# EAGLE design NodeSimpleEthernet (EAGLE 4.16)
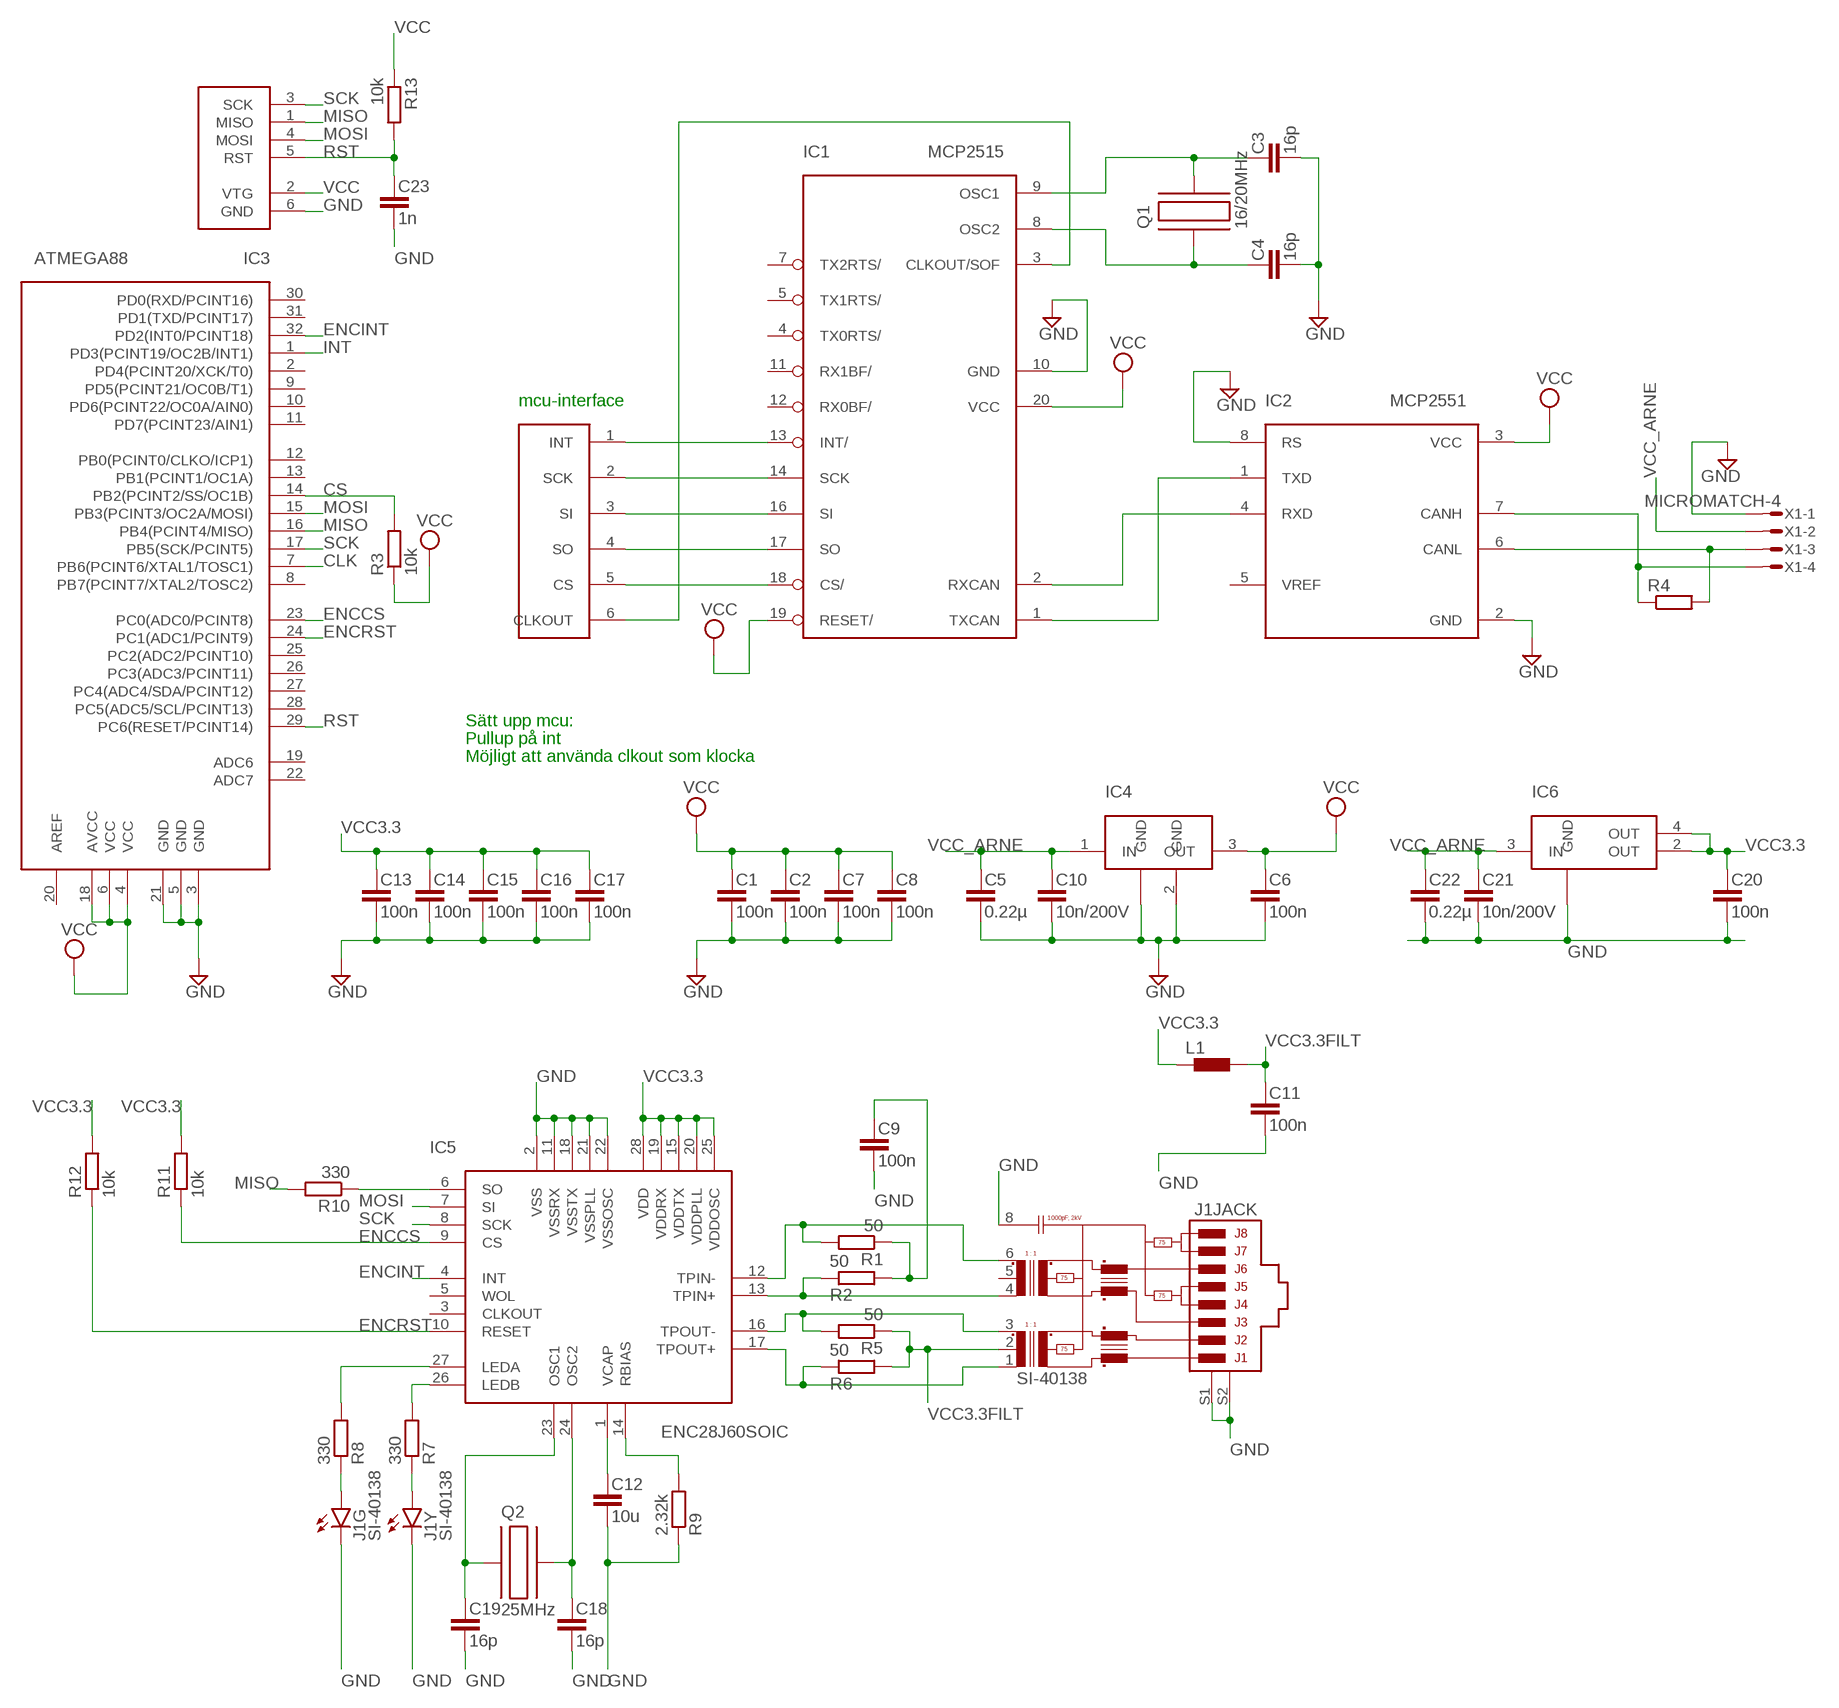
[diagram p0: schematic, sheet 1]

## Parts
C1  100n  C-EU  [C0603]
C2  100n  C-EU  [C0603]
C3  16p  C-EU  [C0603]
C4  16p  C-EU  [C0603]
C5  0.22µ  C-EU  [C0603]
C6  100n  C-EU  [C0603]
C7  100n  C-EU  [C0603]
C8  100n  C-EU  [C0603]
C9  100n  C-EU  [C0603]
C10  10n/200V  C-EU  [C0603]
C11  100n  C-EU  [C0603]
C12  10u  C-EU  [C0603]
C13  100n  C-EU  [C0603]
C14  100n  C-EU  [C0603]
C15  100n  C-EU  [C0603]
C16  100n  C-EU  [C0603]
C17  100n  C-EU  [C0603]
C18  16p  C-EU  [C0603]
C19  16p  C-EU  [C0603]
C20  100n  C-EU  [C0603]
C21  10n/200V  C-EU  [C0603]
C22  0.22µ  C-EU  [C0603]
C23  1n  C-EU  [C0603]
IC1  MCP2515  [TSSOP]
IC2  MCP2551  [SOIC]
IC3  ATMEGA88  [TQFP32]
IC4  LM340MP-5.0  [SOT223]
IC5  ENC28J60SOIC  [SOIC-28]
IC6  LM1117MP-3.3  [SOT223]
J1  SI-40138  [SI-40138]
L1  L-EUL0603  [L0603]
Q1  16/20MHz  C-MAC-LFA147E  [SMD]
Q2  25MHz  C-MAC-LFA147E  [SMD]
R1  50  R-EUR0603  [R0603]
R2  50  R-EUR0603  [R0603]
R3  10k  R-EUR0603  [R0603]
R4  R-EUR0603  [R0603]
R5  50  R-EUR0603  [R0603]
R6  50  R-EUR0603  [R0603]
R7  330  R-EUR0603  [R0603]
R8  330  R-EUR0603  [R0603]
R9  2.32k  R-EUR0603  [R0603]
R10  330  R-EUR0603  [R0603]
R11  10k  R-EUR0603  [R0603]
R12  10k  R-EUR0603  [R0603]
R13  10k  R-EUR0603  [R0603]
U$1  CAN-INTERFACE  [VIA-LIST]
X1  MICROMATCH-4  [MICROMATCH-4]
X2  AVRISP6PIN  [6PIN]

## Nets
CANH: IC2.7(CANH) R4.1 X1.4
CANL: IC2.6(CANL) R4.2 X1.3
CLK: IC1.3(CLKOUT/SOF) IC3.7(PB6(PCINT6/XTAL1/TOSC1)) U$1.6(CLKOUT)
CS: IC1.18(CS/) IC3.14(PB2(PCINT2/SS/OC1B)) R3.2 U$1.5(CS)
ENCCS: IC3.23(PC0(ADC0/PCINT8)) IC5.9(CS) R11.1
ENCINT: IC3.32(PD2(INT0/PCINT18)) IC5.4(INT)
ENCRST: IC3.24(PC1(ADC1/PCINT9)) IC5.10(RESET) R12.1
GND: C1.2 C2.2 C3.2 C4.2 C5.2 C6.2 C7.2 C8.2 C9.2 C10.2 C11.2 C12.2 C13.2 C14.2 C15.2 C16.2 C17.2 C18.2 C19.2 C20.2 C21.2 C22.2 C23.2 IC1.10(GND) IC2.2(GND) IC2.8(RS) IC3.3(GND) IC3.5(GND) IC3.21(GND) IC4.2(GND) IC4.4(GND) IC5.2(VSS) IC5.11(VSSRX) IC5.18(VSSTX) IC5.21(VSSPLL) IC5.22(VSSOSC) IC6.1(GND) J1.8(JACK:GND) J1.GC(G:C) J1.S1(JACK:S1) J1.S2(JACK:S2) J1.YC(Y:C) R9.1 X1.1 X2.6(GND)
INT: IC1.13(INT/) IC3.1(PD3(PCINT19/OC2B/INT1)) U$1.1(INT)
MISO: IC1.17(SO) IC3.16(PB4(PCINT4/MISO)) R10.2 U$1.4(SO) X2.1(MISO)
MOSI: IC1.16(SI) IC3.15(PB3(PCINT3/OC2A/MOSI)) IC5.7(SI) U$1.3(SI) X2.4(MOSI)
N$1: IC1.2(RXCAN) IC2.4(RXD)
N$2: IC1.1(TXCAN) IC2.1(TXD)
N$3: IC5.12(TPIN-) J1.6(JACK:TD+) R1.2
N$4: IC5.13(TPIN+) J1.4(JACK:TD-) R2.1
N$5: IC5.16(TPOUT-) J1.3(JACK:RD+) R5.2
N$6: IC5.17(TPOUT+) J1.1(JACK:RD-) R6.1
N$9: IC5.27(LEDA) R8.2
N$11: C9.1 R1.1 R2.2
N$12: C3.1 IC1.9(OSC1) Q1.P$2
N$13: C4.1 IC1.8(OSC2) Q1.P$1
N$14: IC5.26(LEDB) R7.2
N$15: C19.1 IC5.23(OSC1) Q2.P$1
N$16: C18.1 IC5.24(OSC2) Q2.P$2
N$17: C12.1 IC5.1(VCAP)
N$18: IC5.14(RBIAS) R9.2
N$19: J1.YA(Y:A) R7.1
N$20: J1.GA(G:A) R8.1
RST: C23.1 IC3.29(PC6(RESET/PCINT14)) R13.2 X2.5(RST)
SCK: IC1.14(SCK) IC3.17(PB5(SCK/PCINT5)) IC5.8(SCK) U$1.2(SCK) X2.3(SCK)
SO: IC5.6(SO) R10.1
VCC: C1.1 C2.1 C6.1 C7.1 C8.1 IC1.19(RESET/) IC1.20(VCC) IC2.3(VCC) IC3.4(VCC) IC3.6(VCC) IC3.18(AVCC) IC4.3(OUT) R3.1 R13.1 X2.2(VTG)
VCC3.3: C13.1 C14.1 C15.1 C16.1 C17.1 C20.1 IC5.15(VDDTX) IC5.19(VDDRX) IC5.20(VDDPLL) IC5.25(VDDOSC) IC5.28(VDD) IC6.2(OUT) IC6.4(OUT) L1.1 R11.2 R12.2
VCC3.3FILT: C11.1 J1.2(JACK:CTR) L1.2 R5.1 R6.2
VCC_ARNE: C5.1 C10.1 C21.1 C22.1 IC4.1(IN) IC6.3(IN) X1.2
Unconnected: IC1.4(TX0RTS/) IC1.5(TX1RTS/) IC1.7(TX2RTS/) IC1.11(RX1BF/) IC1.12(RX0BF/) IC2.5(VREF) IC3.2(PD4(PCINT20/XCK/T0)) IC3.8(PB7(PCINT7/XTAL2/TOSC2)) IC3.9(PD5(PCINT21/OC0B/T1)) IC3.10(PD6(PCINT22/OC0A/AIN0)) IC3.11(PD7(PCINT23/AIN1)) IC3.12(PB0(PCINT0/CLKO/ICP1)) IC3.13(PB1(PCINT1/OC1A)) IC3.19(ADC6) IC3.20(AREF) IC3.22(ADC7) IC3.25(PC2(ADC2/PCINT10)) IC3.26(PC3(ADC3/PCINT11)) IC3.27(PC4(ADC4/SDA/PCINT12)) IC3.28(PC5(ADC5/SCL/PCINT13)) IC3.30(PD0(RXD/PCINT16)) IC3.31(PD1(TXD/PCINT17)) IC5.3(CLKOUT) IC5.5(WOL) J1.5(JACK:CTT)

## Notes on the sheet
- mcu-interface
- Sätt upp mcu:
- Pullup på int
- Möjligt att använda clkout som klocka

## Library data of the parts
C1-C23 = rcl:C-EU
IC1 = mcp2515:MCP2515
IC2 = mcp2551:MCP2551
IC3 = atmega88:ATMEGA88
IC4 = lm340mp:LM340MP-5.0
IC5 = enc28j60:ENC28J60
IC6 = lm1117mp:LM1117MP-3.3
J1 = stewart_magjack:SI-40138
L1 = rcl:L-EU
Q1 Q2 = hc49-4h-smx:C-MAC-LFA147E
R1-R13 = rcl:R-EU
U$1 = can-interface:CAN-INTERFACE
X1 = con-amp-micromatch:MICROMATCH-4: MicroMaTch 4 7-215464-4 / 0-215464-4 Drawing Number C-215464 DDEController.pdf
X2 = avrisp:AVRISP6PIN

## Board
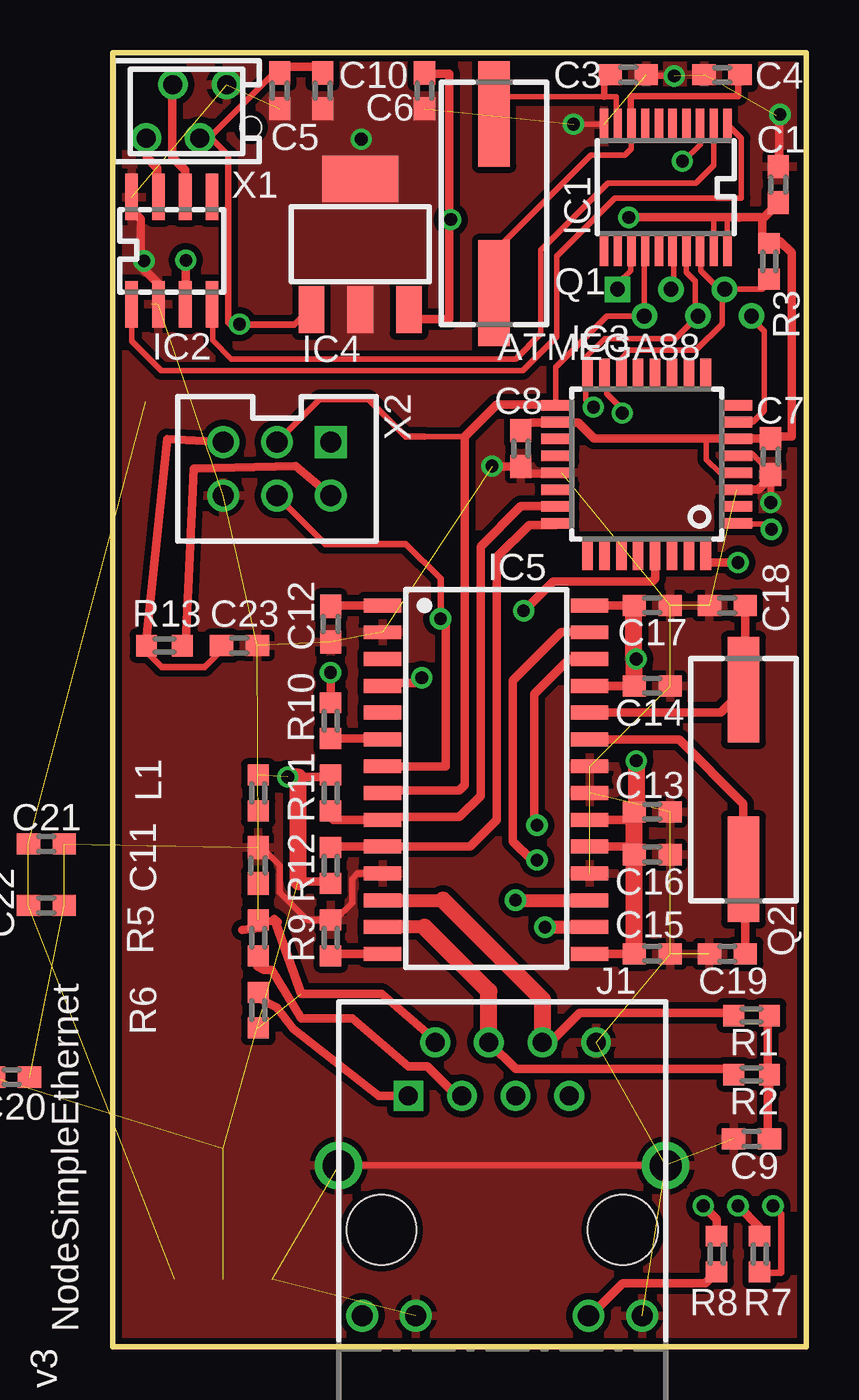
[diagram p1: board, top side]
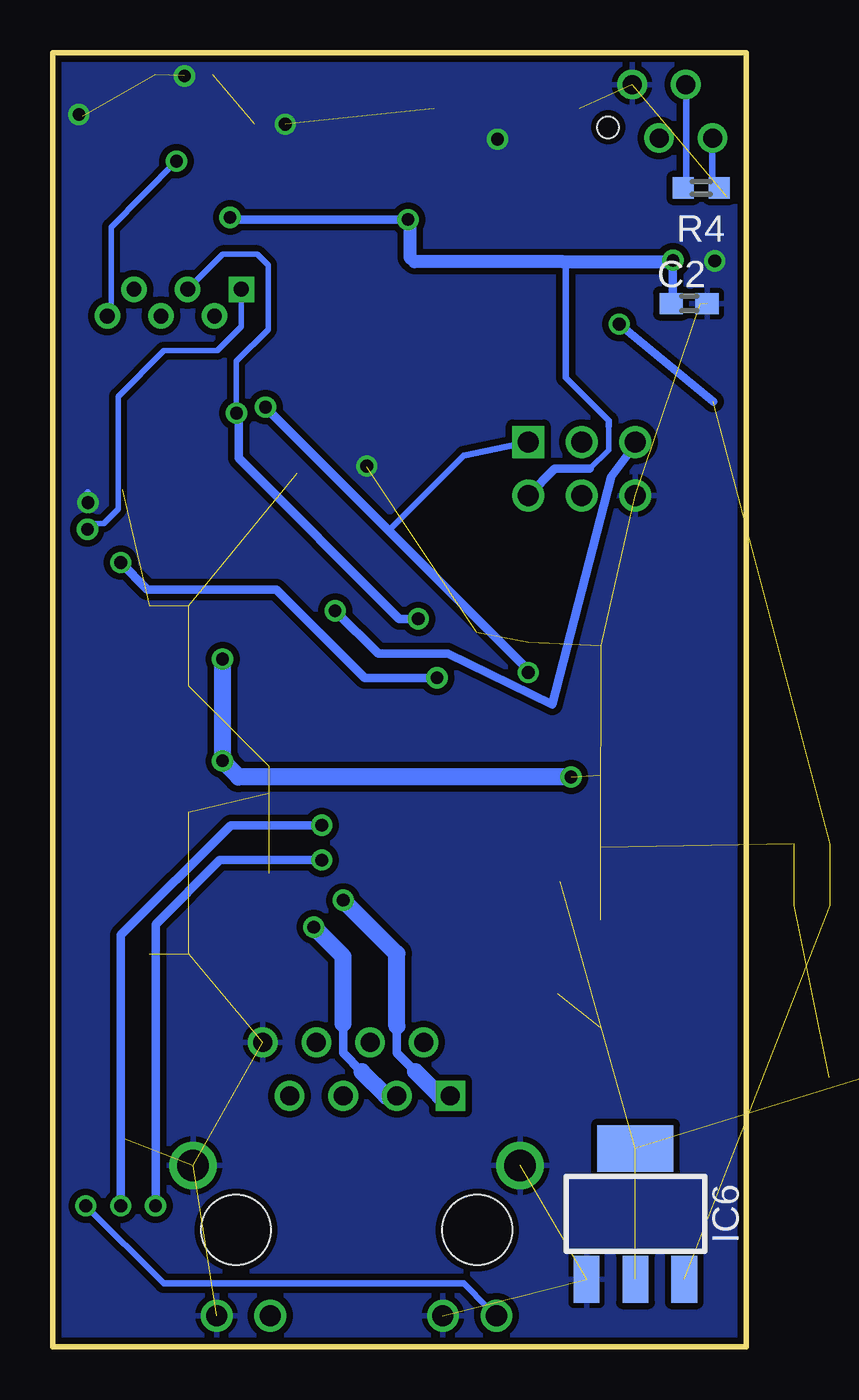
[diagram p2: board, bottom side, seen from below]

Size 32.85 x 61.32 mm. Coordinates in mm from the lower left corner, seen from the top.
Outline: 0,0 32.85,0 32.85,61.32 0,61.32 0,0
Copper layers (1*16): Top 0.035mm / dielectric 1.5mm / Bottom 0.035mm
Design rules "10mils, 0.6drill": minimum track width 10mil, minimum drill 0.6mm, track to track 10mil, track to pad 10mil, pad to pad 10mil, via to via 10mil, smd to smd 10mil, copper to edge 10mil, drill to drill 10mil, minimum pad ring 10mil, minimum via ring 8mil, stop-mask expansion 0mil, vias tented up to drill 0mil, thermal gap 10mil

### Footprints (pad centres in the part's own frame; a part is rotated, then mirrored left to right if it is on the bottom)
C0603 = smd 1.1 x 1: 1 -0.85,0; 2 0.85,0
TSSOP = smd 0.396 x 1.5: 1 -2.925,-2.975; 2 -2.275,-2.975; 3 -1.625,-2.975; 4 -0.975,-2.975; 5 -0.325,-2.975; 6 0.325,-2.975; 7 0.975,-2.975; 8 1.625,-2.975; 9 2.275,-2.975; 10 2.925,-2.975; 11 2.925,2.975; 12 2.275,2.975; 13 1.625,2.975; 14 0.975,2.975; 15 0.325,2.975; 16 -0.325,2.975; 17 -0.975,2.975; 18 -1.625,2.975; 19 -2.275,2.975; 20 -2.925,2.975
SOIC = smd 0.6 x 2.2: 1 -1.905,-2.54; 2 -0.635,-2.54; 3 0.635,-2.54; 4 1.905,-2.54; 5 1.905,2.54; 6 0.635,2.54; 7 -0.635,2.54; 8 -1.905,2.54
TQFP32 = smd 1.5 x 0.5: 1 -4.25,2.65; 2 -4.25,1.85; 3 -4.25,1.05; 4 -4.25,0.25; 5 -4.25,-0.55; 6 -4.25,-1.35; 7 -4.25,-2.15; 8 -4.25,-2.95; 17 4.25,-2.95; 18 4.25,-2.15; 19 4.25,-1.35; 20 4.25,-0.55; 21 4.25,0.25; 22 4.25,1.05; 23 4.25,1.85; 24 4.25,2.65 | smd 0.5 x 1.5: 9 -2.8,-4.4; 10 -2,-4.4; 11 -1.2,-4.4; 12 -0.4,-4.4; 13 0.4,-4.4; 14 1.2,-4.4; 15 2,-4.4; 16 2.8,-4.4; 25 2.8,4.1; 26 2,4.1; 27 1.2,4.1; 28 0.4,4.1; 29 -0.4,4.1; 30 -1.2,4.1; 31 -2,4.1; 32 -2.8,4.1
SOT223 = smd 1.219 x 2.235: 1 -2.311,-3.099; 2 0,-3.099; 3 2.311,-3.099 | smd 3.6 x 2.2: 4 0,3.099
SOIC-28 = smd 0.66 x 1.778: 1 -6.985,-4.902; 2 -5.715,-4.902; 3 -4.445,-4.902; 4 -3.175,-4.902; 5 -1.905,-4.902; 6 -0.635,-4.902; 7 0.635,-4.902; 8 1.905,-4.902; 9 3.175,-4.902; 10 4.445,-4.902; 11 5.715,-4.902; 12 6.985,-4.902; 13 8.255,-4.902; 14 9.525,-4.902; 15 9.525,4.902; 16 8.255,4.902; 17 6.985,4.902; 18 5.715,4.902; 19 4.445,4.902; 20 3.175,4.902; 21 1.905,4.902; 22 0.635,4.902; 23 -0.635,4.902; 24 -1.905,4.902; 25 -3.175,4.902; 26 -4.445,4.902; 27 -5.715,4.902; 28 -6.985,4.902
SI-40138 = drill 0.9 square: 1 -4.445,6.35 | drill 0.9 round: 2 -3.175,8.89; 3 -1.905,6.35; 4 -0.635,8.89; 5 0.635,6.35; 6 1.905,8.89; 7 3.175,6.35; 8 4.445,8.89 | drill 1 round: GA 4.089,-4.064; GC 6.629,-4.064; YA -6.629,-4.064; YC -4.089,-4.064 | drill 1.5 round: S1 -7.747,3.048; S2 7.747,3.048 | hole 3.3: -5.715,0; 5.715,0
L0603 = smd 0.991 x 1.016: 1 -0.85,0; 2 0.85,0
SMD = smd 5 x 1.5: P$1 4.25,0; P$2 -4.25,0
R0603 = smd 0.991 x 1.016: 1 -0.85,0; 2 0.85,0
VIA-LIST = drill 0.7 square: 1 0,2.54 | drill 0.7 round: 2 -1.27,1.27; 3 0,0; 4 -1.27,-1.27; 5 0,-2.54; 6 -1.27,-3.81
MICROMATCH-4 = drill 0.9 round: 1 1.905,1.27; 2 0.635,-1.27; 3 -0.635,1.27; 4 -1.905,-1.27 | hole 1: 3.048,-0.762
6PIN = drill 1 square: 1 -1.27,2.54 | drill 1 round: 2 1.27,2.54; 3 -1.27,0; 4 1.27,0; 5 -1.27,-2.54; 6 1.27,-2.54

### Placement (x,y rotation side)
C1  31.54,55.07 90 top
C2  2.7,49.44 0 bottom
C3  24.43,60.27 0 top
C4  28.87,60.27 180 top
C5  7.92,59.51 270 top
C6  14.77,59.51 270 top
C7  31.17,42.18 270 top
C8  19.34,42.56 270 top
C9  30.27,9.86 180 top
C10  9.95,59.51 270 top
C11  6.9,22.81 90 top
C12  10.33,34.24 270 top
C13  25.57,25.35 0 top
C14  25.57,31.32 0 top
C15  25.57,18.62 0 top
C16  25.57,23.32 0 top
C17  25.57,35.13 0 top
C18  29.12,35.13 180 top
C19  29.12,18.62 180 top
C20  -4.78,12.78 0 top  (outside the outline)
C21  -3.13,23.83 0 top
C22  -3.13,20.91 0 top
C23  6.01,33.22 0 top
IC1  26.21,54.94 180 top
IC2  2.8,51.94 0 top
IC3  25.3,41.67 180 top
IC4  11.73,52.25 0 top
IC5  17.7,28.14 270 top
IC6  5.25,6.3 0 bottom
J1  18.46,5.54 0 top
L1  6.9,26.24 270 top
Q1  18.08,54.18 270 top
Q2  29.89,26.87 270 top
R1  30.27,15.7 180 top
R2  30.27,12.9 0 top
R3  31.11,51.44 270 top
R4  2.12,54.92 180 bottom
R5  6.9,19.38 270 top
R6  6.9,15.95 270 top
R7  30.65,4.39 90 top
R8  28.62,4.39 90 top
R9  10.33,19.38 270 top
R10  10.33,29.67 90 top
R11  10.33,26.24 90 top
R12  10.33,22.81 270 top
R13  2.46,33.22 180 top
U$1  26.46,50.12 90 top
X1  3.5,58.55 0 top
X2  7.79,41.61 270 top

### Tracks (layer width: path | path; a pad name or v marks a point on that pad's centre or on a via)
CANH
  Top 0.305: 2.12,54.52 IC2.7 | X1.4 1.62,57.28
  Top 0.406: 2.12,54.52 2.12,55.86 1.62,56.36 1.62,57.28
  Bottom 0.305: X1.4 1.62,57.28 1.62,55.26 R4.1
CANL
  Top 0.305: IC2.6 | X1.3 2.84,59.82
  Top 0.406: IC2.6 3.45,55.75 2.84,56.36 2.84,59.82
  Bottom 0.305: X1.3 2.84,59.82 2.84,55.05 R4.2
CLK  (via drill 0.6)
  Top 0.254: IC1.3 27.83,57.81 27.83,56.97 27.02,56.16 v26.99,56.19 | IC3.7 30.32,43.82 30.88,44.38 30.88,48.13 30.22,48.79 30.17,48.84
  Top 0.406: 30.17,48.74 30.22,48.79 U$1.6
  Bottom 0.254: v26.99,56.19 30.09,53.06 30.09,49 U$1.6
CS
  Top 0.254: IC1.18 27.83,52.09 27.86,52.09 27.86,51 28.87,49.99 | IC3.14 24.07,46.2 | 24.07,46.2 24.07,46.22 | 28.87,49.99 28.87,48.46 27.63,47.22 24.48,47.22 24.07,46.81 24.07,46.41 24.17,45.7 24.07,46.2 | 28.87,49.99 U$1.5 30.78,50.12 31.03,50.37 31.03,50.57 30.97,50.57 R3.2
ENCCS
  Top 0.406: R11.1 10.46,25.39 10.46,24.97 IC5.9 13,24.97 13.12,25.1 16.43,25.1 17.44,26.11 17.44,37.92 19.35,39.83 21,39.83 21.01,39.82 IC3.23
ENCINT  (via drill 0.6)
  Top 0.406: IC5.4 12.87,31.32 13,31.45 14.65,31.45 v14.65,31.7 | IC3.32 28.1,37.42 28.11,37.16 v29.63,37.16
  Bottom 0.406: v14.65,31.7 18.08,31.7 22.27,35.89 28.36,35.89 v29.63,37.16
ENCRST
  Top 0.406: R12.1 10.33,23.7 IC5.10 16.93,23.7 18.2,24.97 18.2,37.41 19.73,38.94 21,38.94 21.05,38.99 IC3.24
GND  (via drill 0.6)  (33 unrouted)
  Top 0.254: v21.84,57.94 23.28,57.94 IC1.10 | C1.2 31.59,56.24 | 1.34,51.21 v1.49,51.46 | 20.56,41.38 IC3.21 21.28,41.4 | C8.2 19.8,41.38 | C7.2 31.11,41.66 30.93,41.66 30.32,42.29 29.76,42.24 29.74,42.22 IC3.5 | v31.61,58.4 31.44,58.34 31.59,58.19
  Top 0.305: IC2.2 2.2,49.73 | C3.2 25.45,60.22 v26.61,60.22 | 30.93,41.66 31.16,41.66 31.18,41.63 31.18,41.12 v31.18,40.01 | J1.S1 J1.S2 | IC5.11 11.6,22.43 11.34,22.18 11.34,21.03 10.46,20.14 10.37,20.23 R9.1 9.23,20.23 7.92,21.54 7.92,22.81 6.9,23.83 6.86,23.66 C11.2
  Top 0.406: 2.2,49.73 2.2,50.34 1.34,51.21 1.34,53.44 0.83,53.95 IC2.8 | 19.8,41.38 20.56,41.38 | 31.59,56.24 31.59,58.19 | 31.18,41.12 31.08,41.12 30.58,40.62 IC3.3 | C8.2 18,41.71 v17.97,41.73
  Bottom 0.305: v26.61,60.22 26.56,60.3 | v31.18,40.01 31.18,40.51
  Bottom 0.406: v17.97,41.73 18.08,41.73
  other vias: 11.78,57.22
  pour Bottom (isolate 0.305, rank 2): 0.12,61.21 32.83,61.21 32.83,0.1 24.38,0.1 0.12,0.1
  pour Top (isolate 0.305, no thermals): 5.83,60.85 15.89,60.85 15.89,47.13 5.83,47.13
  pour Top (isolate 0.305, rank 2): 0.17,61.16 32.68,61.16 32.68,0.08 0.17,0.08
INT  (via drill 0.6)
  Top 0.254: IC1.13 | IC1.13 | U$1.1 23.92,50.37 24.55,51 24.55,51.94 IC1.13 | IC3.1 29.48,39.02 29.46,38.99 30.01,39.04 30.07,38.99 30.95,38.99 v31.21,38.74
  Bottom 0.254: v31.21,38.74 30.9,39.02 30.45,39.02 29.76,39.7 29.76,45.04 27.6,47.19 25.06,47.19 23.92,48.34 U$1.1
MISO  (via drill 0.6)
  Top 0.254: IC1.17 27.18,52.03 27.17,52.02 27.17,50.93 27.6,50.5 27.6,49.1 27.73,48.97 U$1.4 26.66,47.78 23.31,47.78 22.45,46.91 22.45,45.59 22.44,45.59 22.41,45.59 | 22.41,45.59 IC3.16 | 22.41,45.59 22.39,45.66 | 22.41,45.59 22.41,44.89 v22.77,44.53
  Top 0.406: R10.2 v10.33,31.95
  Bottom 0.305: X2.1 13.38,42.24 16.93,38.69
  Bottom 0.406: v22.77,44.53 16.93,38.69 10.33,32.08 v10.33,31.95
MOSI  (via drill 0.6)
  Top 0.254: IC1.16 26.53,52.09 26.51,52.07 26.51,51.84 26.58,51.77 26.58,50.24 U$1.3 | IC3.15 23.3,46.04 23.26,46 23.26,45.95 23.41,45.8 23.41,45.16 24.15,44.43 v24.15,44.25
  Top 0.305: v15.54,34.49 15.54,36.4 13.88,38.05 10.07,38.05 X2.4
  Top 0.406: IC5.7 15.79,27.51 15.79,34.37 v15.54,34.49
  Bottom 0.254: U$1.3 26.51,50.17 | U$1.3 26.41,50.06 | v24.15,44.25 24.15,46.71 22.65,48.21 22.65,51.26 23.16,51.77 24.81,51.77 U$1.3
  Bottom 0.406: v15.54,34.49 16.43,34.49 24.04,42.11 24.04,44.15 v24.15,44.25 23.92,44.27
N$1
  Top 0.254: 4.77,49.35 4.75,49.35 IC2.4 4.71,49.38 4.74,49.35 4.74,47.7 5.63,46.81 19.09,46.81 20.29,48.01 20.29,51.97 23.46,55.14 27.63,55.14 28.48,56 IC1.2
N$2
  Top 0.254: IC1.1 29.79,57.27 29.79,54.43 23.79,54.43 21.05,51.69 21.05,47.88 19.42,46.25 2.3,46.25 0.91,47.65 IC2.1 | IC2.1 0.91,49.45 | IC2.1
N$3
  Top 0.406: R1.2 29.29,15.79 29.12,15.82 22.14,15.82 20.74,14.43 J1.6
  Top 0.61: IC5.12 15.66,21.16
  Top 0.813: J1.6 20.36,16.46 15.66,21.16
N$4
  Top 0.406: R2.1 29.42,12.74 29.25,13.16 19.09,13.16 J1.4
  Top 0.61: 14.77,19.89 IC5.13
  Top 0.813: J1.4 17.82,16.84 14.77,19.89
N$5  (via drill 0.6)
  Top 0.406: R5.2 6.86,18.02 7.15,17.86 7.54,17.86 8.93,15.57 11.34,15.57 14.01,13.29 14.9,13.29 16.3,11.89 J1.3
  Top 0.61: v20.49,19.89 IC5.16
  Bottom 0.406: 18.2,13.03 19.09,13.92 19.09,15.32
  Bottom 0.813: J1.3 17.06,11.89 18.2,13.03 | 19.09,15.32 19.09,18.49 v20.49,19.89
N$6  (via drill 0.6)
  Top 0.406: R6.1 7.11,16.42 7.79,16.08 8.55,15.06 12.61,11.89 J1.1 | IC5.17 22.65,21.16
  Top 0.61: v19.09,21.16 IC5.17
  Bottom 0.406: 15.66,13.03 16.55,13.92 16.55,15.19
  Bottom 0.813: J1.1 14.52,11.89 15.66,13.03 | 16.55,15.19 16.55,18.62 v19.09,21.16
N$9  (via drill 0.6)
  Top 0.406: R8.2 28.62,6.05 v27.98,6.68 | v20.11,23.06 19.85,23.06 18.96,23.95 18.96,31.57 21.25,33.86 IC5.27
  Bottom 0.406: v27.98,6.68 27.98,20.02 24.93,23.06 v20.11,23.06
N$11
  Top 0.406: C9.1 31.32,10.02 31.03,10.11 31.03,11.89 31.12,11.98 R2.2 31.12,12.05 31.03,12.14 31.03,15.57 R1.1
N$12
  Top 0.254: IC1.9 23.87,58.27 23.87,59.23 23.28,59.23 18.13,59.23 Q1.P$2
  Top 0.305: C3.1 23.28,59.8 23.28,59.23
N$13
  Top 0.254: Q1.P$1 18.14,51.96 22.65,56.47 24.27,56.47 24.58,56.77 24.58,57.68 24.55,57.71 24.55,57.79
  Top 0.305: IC1.8 24.55,57.79 24.55,59.26 29.63,59.26 29.63,60.31 C4.1
N$14  (via drill 0.6)
  Top 0.305: R7.2 30.65,5.63
  Top 0.406: 30.65,5.63 v29.63,6.68 | v20.11,24.71 19.98,25.1 19.98,30.94 21.63,32.59 IC5.26
  Bottom 0.406: v29.63,6.68 29.63,19.51 24.43,24.71 v20.11,24.71
N$15
  Top 0.406: 29.89,22.56 Q2.P$1 29.89,22.68 | C19.1 29.97,22.6 29.89,22.68 | 29.89,22.68 29.89,25.73 26.84,28.78 IC5.23
N$16
  Top 0.406: C18.1 29.97,31.15 29.89,31.06 Q2.P$2 28.81,30.05 IC5.24
N$17
  Top 0.406: C12.1 10.33,35.13 IC5.1
N$18
  Top 0.406: R9.2 10.33,18.62 IC5.14
N$19  (via drill 0.6)
  Top 0.305: v31.28,6.68 31.67,6.3 31.67,3.51 30.78,3.51 30.74,3.54 R7.1
  Bottom 0.305: J1.YA 11.83,1.83 11.85,1.85 12.23,1.85 13.38,3 27.6,3 v31.28,6.68
N$20
  Top 0.406: R8.1 28.07,3 24.17,3 22.52,1.35 22.52,1.45 J1.GA
RST  (via drill 0.6)
  Top 0.305: 1.57,33.22 1.57,32.97 2.33,32.21 4.36,32.21 5.16,33.01 C23.1
  Top 0.406: IC3.29 25.7,36.4 25.57,36.27 20.87,36.27 v19.47,34.88 | X2.5 2.58,43 1.57,33.26 R13.2 1.57,33.22
  Bottom 0.406: v19.47,34.88 17.44,32.84 14.14,32.84 9.19,30.43 6.39,41.23 5.25,42.75 X2.5
SCK
  Top 0.254: IC1.14 25.23,52.06 25.19,52.02 IC1.14 25.19,51.97 U$1.2 23.41,48.84 21,46.43 21,44.65 21,44.55 IC3.17 | 16.68,43.13 14.77,43.13
  Top 0.305: 14.77,43.13 13.88,43.13 12.11,44.91 9.82,44.91 X2.3
  Top 0.406: IC5.8 12.87,26.24 13,26.37 16.43,26.37 16.68,26.62 16.68,43.13 18.2,44.65 21,44.65 21.03,44.62 IC3.17
SO
  Top 0.406: IC5.6 12.87,28.78 12.87,28.82 R10.1
VCC  (via drill 0.6)
  Top 0.254: 29.81,43.03 IC3.6 29.05,43.03 | 21.28,43.79 IC3.18 | IC1.20 29.12,52.09 29.12,53.52 29.68,53.52 | IC1.19 28.48,52.03 28.49,52.02 28.49,53.52 28.49,53.54 | 30.57,53.57 30.78,53.57 30.9,53.54 | IC3.4 28.75,41.42 28.13,42.04 28.13,43.03
  Top 0.406: 15.95,53.42 15.95,48.71 14.08,48.71 14.08,49.4 IC4.3 | IC2.3 3.42,49.79 3.47,50.27 v3.47,51.49 | 15.95,53.42 15.95,60.33 14.83,60.33 14.77,60.27 C6.1 | v16.02,53.42 15.95,53.42 | v24.45,53.52 28.49,53.52 29.68,53.52 | 29.68,53.52 | IC3.18 20.56,43.79 19.8,43.79 C8.1 | 29.81,43.03 30.7,43.03 C7.1 31.41,43.13 32.17,43.13 32.17,51.84 31.61,52.4 30.88,52.4 | 21.28,43.79 22.06,43.79 22.83,43.03 28.13,43.03 29.05,43.03 | 29.68,53.52 30.78,53.52 | 30.78,53.52 30.9,53.52 30.9,53.54 C1.1 | 30.88,52.4 30.88,52.31 R3.1 | 30.88,52.4 30.78,52.5 30.78,53.52 | R13.1 3.43,33.35 3.47,33.35 3.85,41.61 8.68,41.73 X2.2
  Bottom 0.254: 3.47,49.94 C2.1 | 7.41,41.61 6.52,42.49 6.52,43.64
  Bottom 0.305: 6.52,43.64 6.52,43.89 8.55,45.92 8.55,51.26 8.68,51.38 8.68,51.41
  Bottom 0.406: 3.47,49.94 3.47,51.41 v3.47,51.49 | v24.45,53.52 24.4,53.52 24.3,53.42 v16.02,53.42 | X2.2 9.06,41.61 7.41,41.61 | C2.1 3.6,49.48 | C2.1 | C2.1 3.34,49.23
  Bottom 0.61: 3.47,51.41 8.68,51.41 15.71,51.41 15.92,51.61 15.92,53.42 v16.02,53.42
VCC3.3  (via drill 0.6)  (4 unrouted)
  Top 0.406: 24.68,35.13 IC5.28 | C14.1 IC5.25 | IC5.20 24.3,24.97 24.68,25.35 | IC5.19 24.3,23.7 24.68,23.32 | C15.1 IC5.15 | v24.81,32.59 24.68,32.59 | R11.2 10.29,27.09 10.2,27 8.8,27 | R12.2 10.29,21.96 10.2,22.05 8.8,22.05
  Top 0.813: 24.68,23.32 C16.1 | C15.1 24.68,18.62 24.68,23.32 | C14.1 24.68,31.32 24.68,32.59 24.68,35.13 C17.1 | 24.68,23.32 24.68,25.35 C13.1 24.81,25.35 v24.81,27.76 | 8.8,22.05 8.8,27 v8.3,27
  Bottom 0.813: v24.81,32.59 v24.81,27.76 24.04,27 v8.3,27
VCC3.3FILT  (3 unrouted)
  Top 0.406: 6.14,19.76 6.99,19.85 R5.1 7.83,20.14 7.66,20.27 8.93,16.71 12.74,16.71 15.41,14.43 J1.2
VCC_ARNE  (via drill 0.6)  (3 unrouted)
  Top 0.254: 7.88,60.33 C5.1
  Top 0.305: IC4.1 9.31,49.15 8.61,48.44 6.14,48.44 5.58,48.44 5.48,48.54 5.48,56.47 4.67,57.28 4.26,57.28 | 7.88,60.33 7.61,60.33 4.56,57.28 4.26,57.28 | 4.26,57.28 X1.2
  Top 0.406: C10.1 9.95,60.66 7.92,60.66 C5.1 | 6.14,48.44 6.26,48.34 v6.01,48.46
  Bottom 0.406: 1.57,44.78 v6.01,48.46

### Text on the board
tPlace: NodeSimpleEthernet | v3